# EasyEDA schematic SCH_plantcare_moisture_module_2025-02-16.json
TITLE: Plantcare moisture module; REV: 1.0; Date: 2025-02-15; Sheet: 1/1; Drawn By: arek.stasko; Company: ArkadiuszS
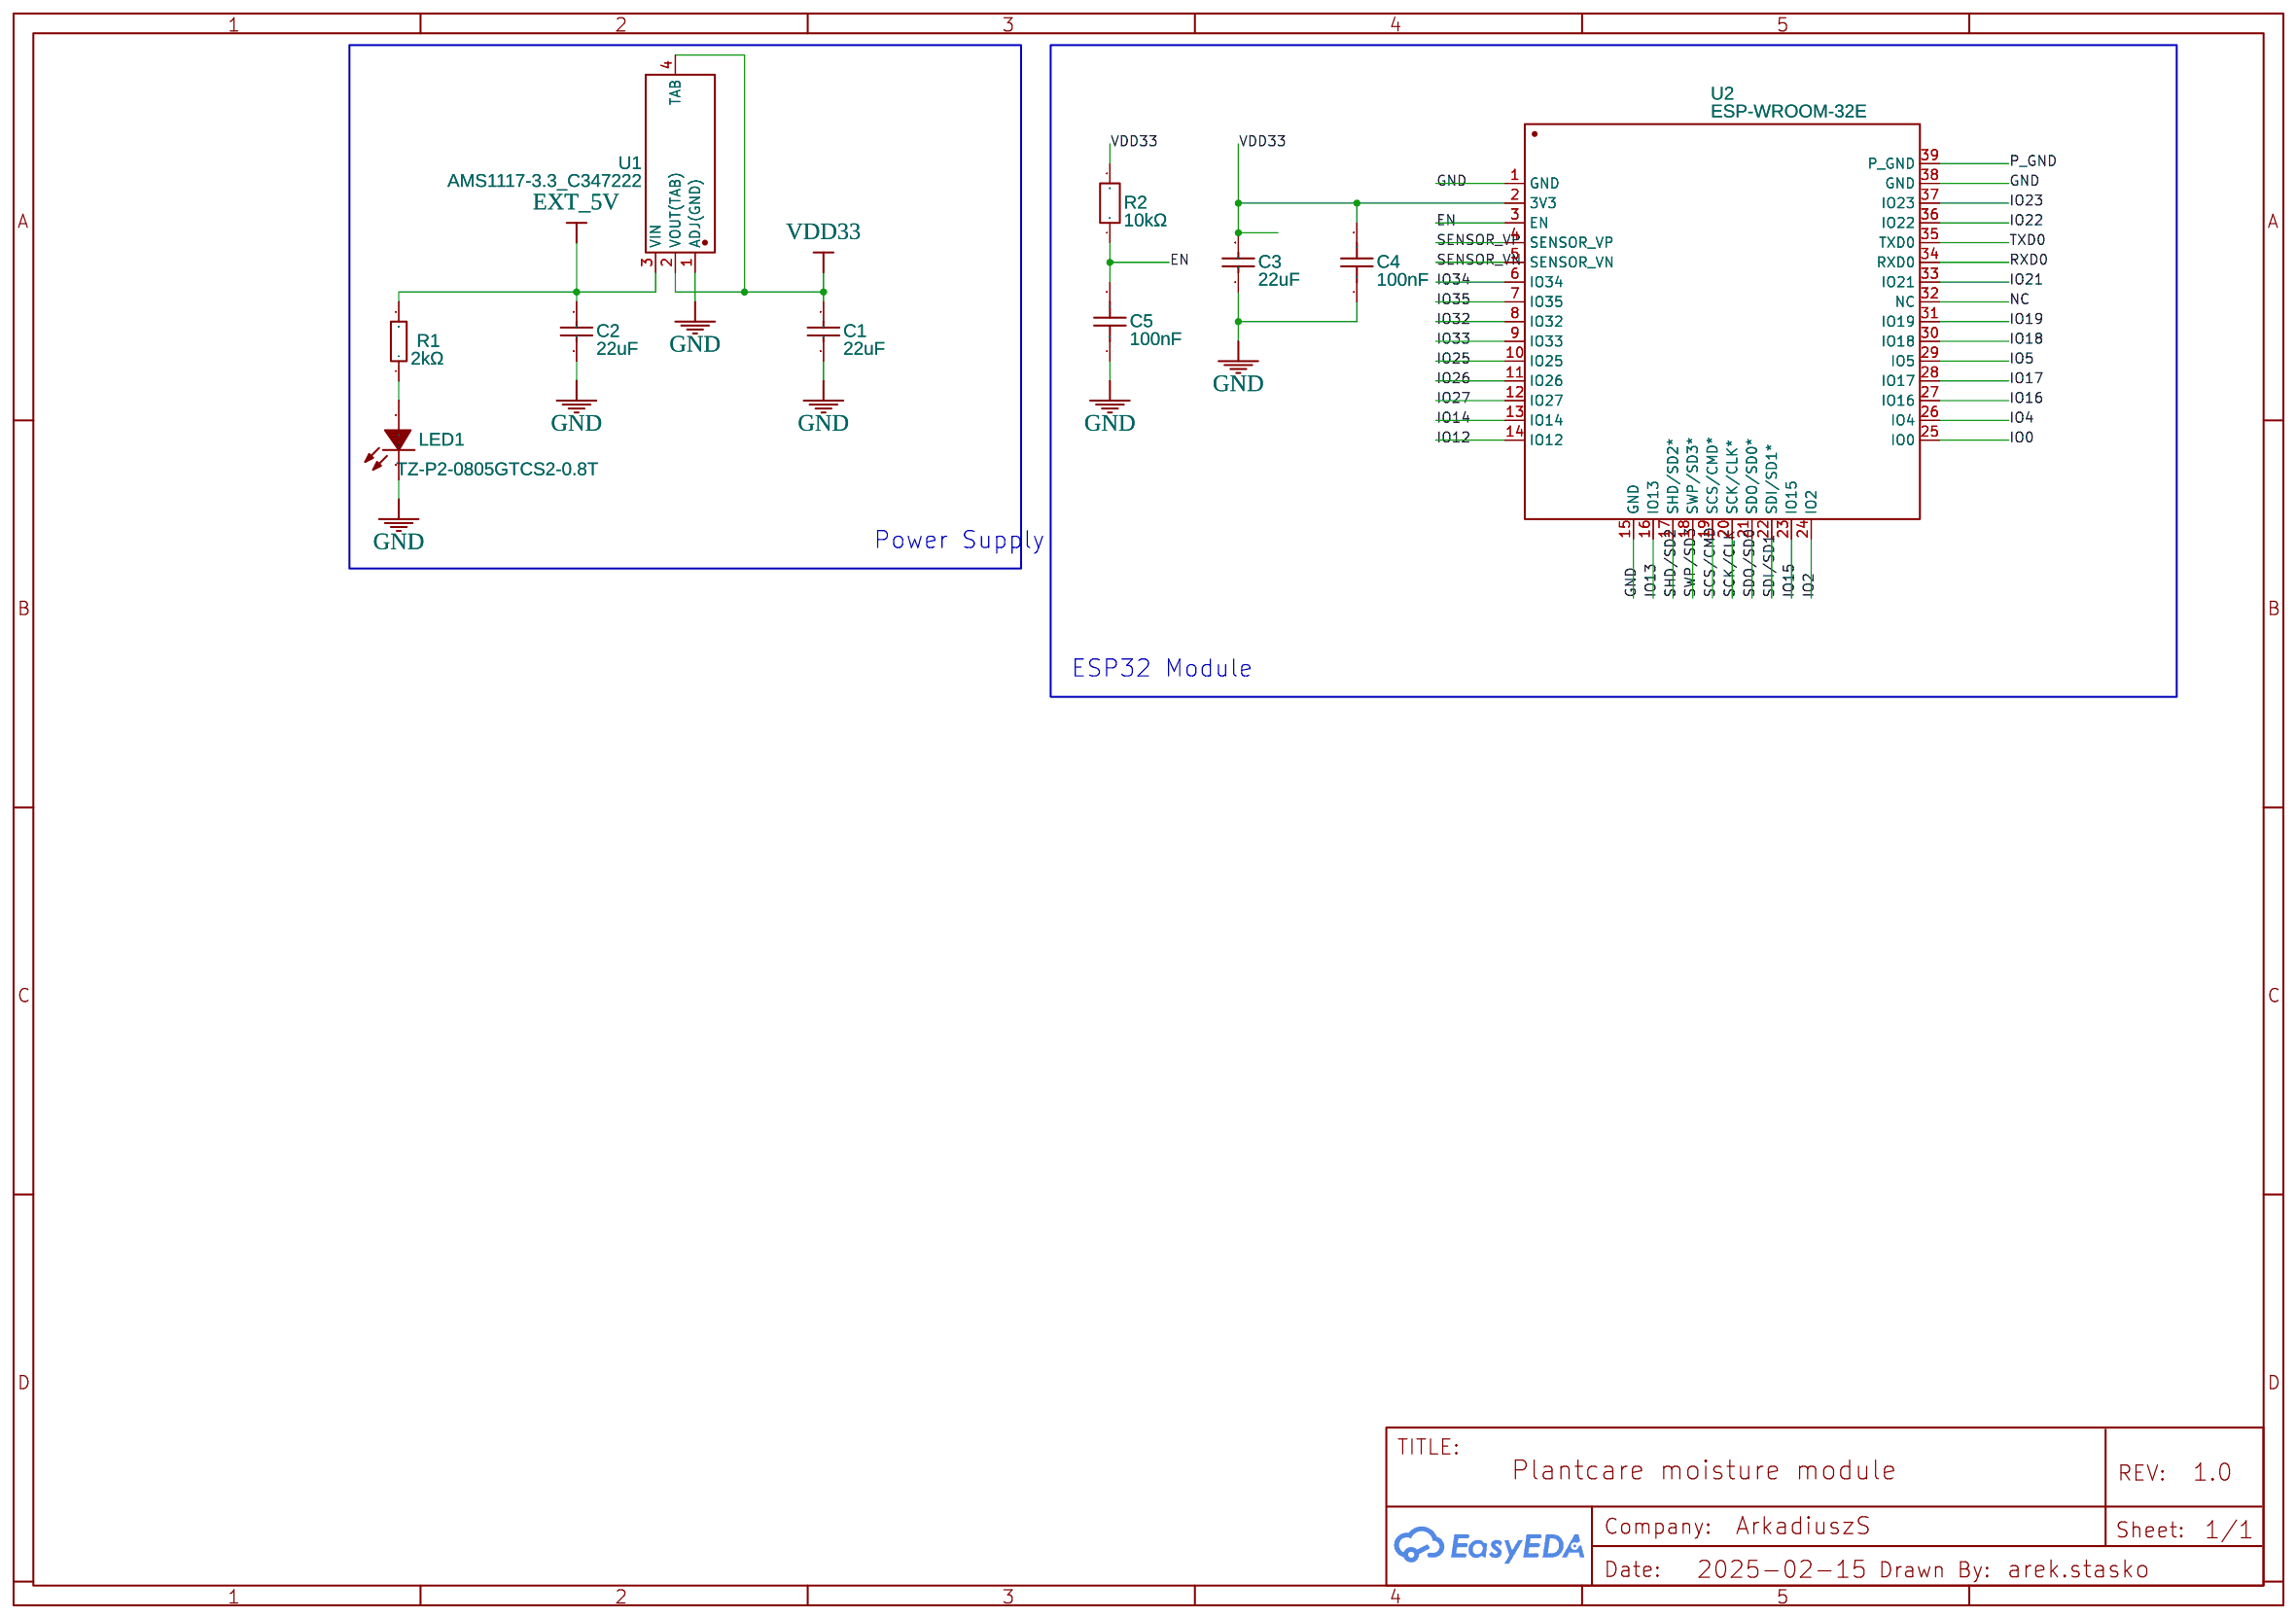
[diagram p0: schematic sheet]

## Parts
C1  22uF  [C0805]
C2  22uF  [C0805]
C3  22uF  [C0805]
C4  100nF  [C0603]
C5  100nF  [C0603]
LED1  TZ-P2-0805GTCS2-0.8T  [LED0805-RD_GREEN]
R1  2kΩ  [R0603]
R2  10kΩ  [R0603]
U1  AMS1117-3.3_C347222  [SOT-223-4_L6.5-W3.5-P2.30-LS7.0-BR]
U2  ESP-WROOM-32E  [COMM-SMD_ESP-WROOM-32D]

## Library data of the parts
C1-C3 = CL21A226MPQNNNE: Supplier: LCSC; Manufacturer: SAMSUNG(三星); Supplier Part: C29277; JLCPCB Part Class: Extended Part
C4 C5 = CL10B104KB8NNNC: Supplier: LCSC; Manufacturer: SAMSUNG(三星); Supplier Part: C1591; JLCPCB Part Class: Extended Part
LED1 = TZ-P2-0805GTCS2-0.8T: Contributor: LCSC; Supplier: LCSC; Supplier Part: C688883; Manufacturer: TUOZHAN(拓展光电); JLCPCB Part Class: Extended Part
R1 = 0603WAF2001T5E: Supplier: LCSC; Manufacturer: UNI-ROYAL(厚声); Supplier Part: C22975; JLCPCB Part Class: Basic Part
R2 = FRC0603J103TS: Contributor: LCSC; Supplier: LCSC; Supplier Part: C2930027; Manufacturer: FOJAN(富捷); JLCPCB Part Class: Extended Part
U1 = AMS1117-3.3_C347222: Contributor: LCSC; Supplier: LCSC; Supplier Part: C347222; Manufacturer: UMW(友台半导体); Manufacturer Part: AMS1117-3.3; JLCPCB Part Class: Extended Part
U2 = ESP-WROOM-32E: Supplier: LCSC; Supplier Part: C19949066; Manufacturer: DOIT(四博智联); Contributor: lcsc; JLCPCB Part Class: Extended Part

## Nets
GND: C1.1 C2.1 C3.1 C4.1 C5.1 LED1.1(-) U1.1(ADJ(GND)) U2.1(GND) U2.15(GND) U2.38(GND)
VDD33: C1.2 C3.2 C4.2 R2.2 U1.2(VOUT(TAB)) U1.4(TAB) U2.2(3V3)
EN: C5.2 R2.1 U2.3(EN)
EXT_5V: C2.2 R1.2 U1.3(VIN)
IO0: U2.25(IO0)
IO2: U2.24(IO2)
IO4: U2.26(IO4)
IO5: U2.29(IO5)
IO12: U2.14(IO12)
IO13: U2.16(IO13)
IO14: U2.13(IO14)
IO15: U2.23(IO15)
IO16: U2.27(IO16)
IO17: U2.28(IO17)
IO18: U2.30(IO18)
IO19: U2.31(IO19)
IO21: U2.33(IO21)
IO22: U2.36(IO22)
IO23: U2.37(IO23)
IO25: U2.10(IO25)
IO26: U2.11(IO26)
IO27: U2.12(IO27)
IO32: U2.8(IO32)
IO33: U2.9(IO33)
IO34: U2.6(IO34)
IO35: U2.7(IO35)
NC: U2.32(NC)
P_GND: U2.39(P_GND)
RXD0: U2.34(RXD0)
SCK/CLK: U2.20(SCK/CLK*)
SCS/CMD: U2.19(SCS/CMD*)
SDI/SD1: U2.22(SDI/SD1*)
SDO/SD0: U2.21(SDO/SD0*)
SENSOR_VN: U2.5(SENSOR_VN)
SENSOR_VP: U2.4(SENSOR_VP)
SHD/SD2: U2.17(SHD/SD2*)
SWP/SD3: U2.18(SWP/SD3*)
TXD0: U2.35(TXD0)
Net-(LED1-2): LED1.2(+) R1.1

## Notes on the sheet
- Power Supply
- ESP32 Module
